# EAGLE board lia (EAGLE 6.1)
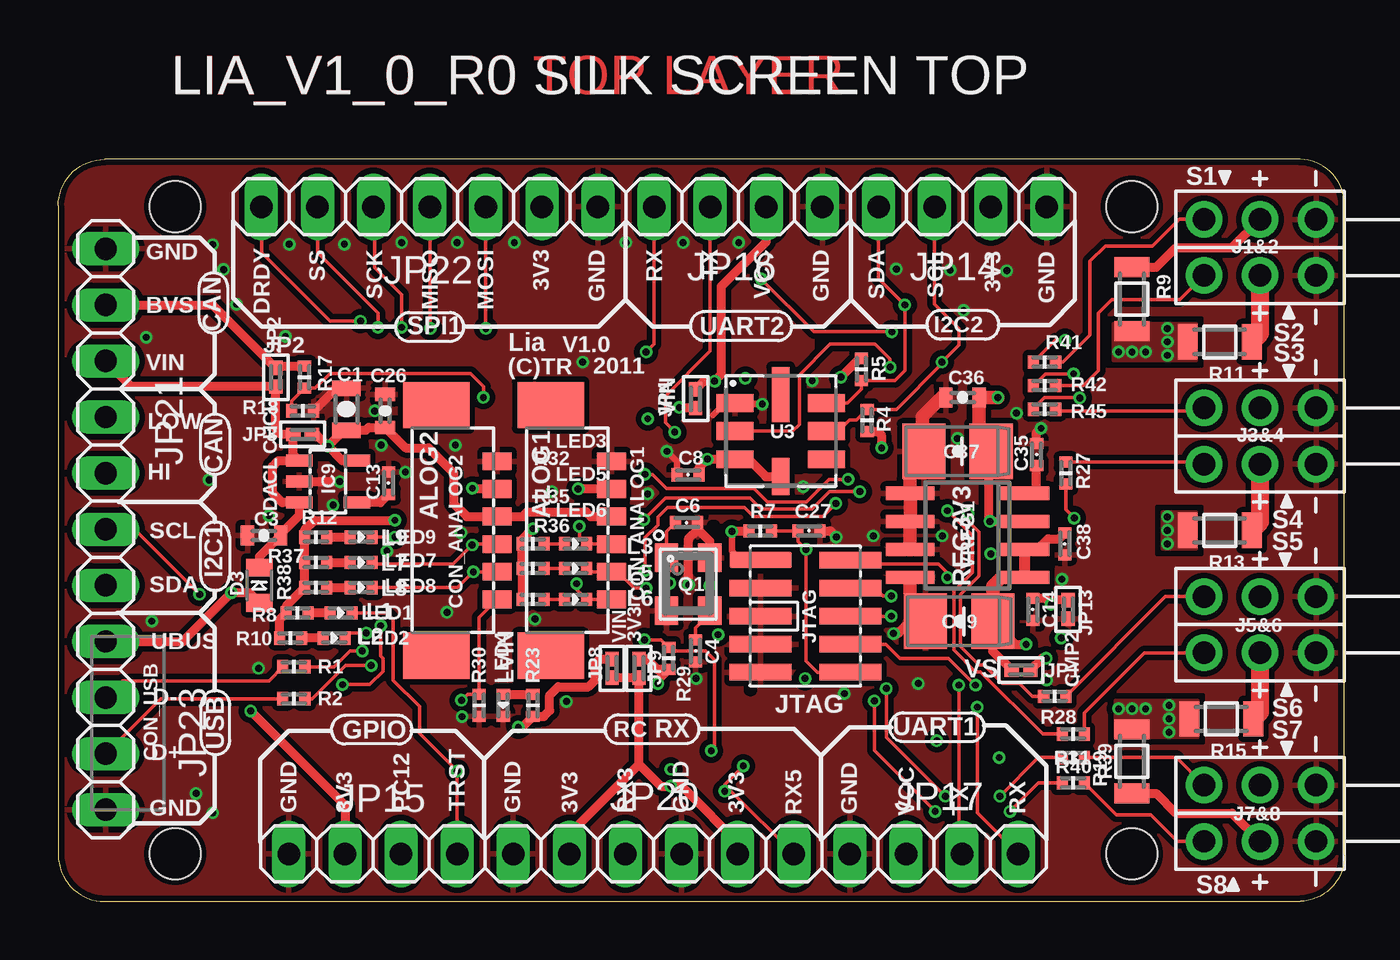
[diagram p3: board, top side]
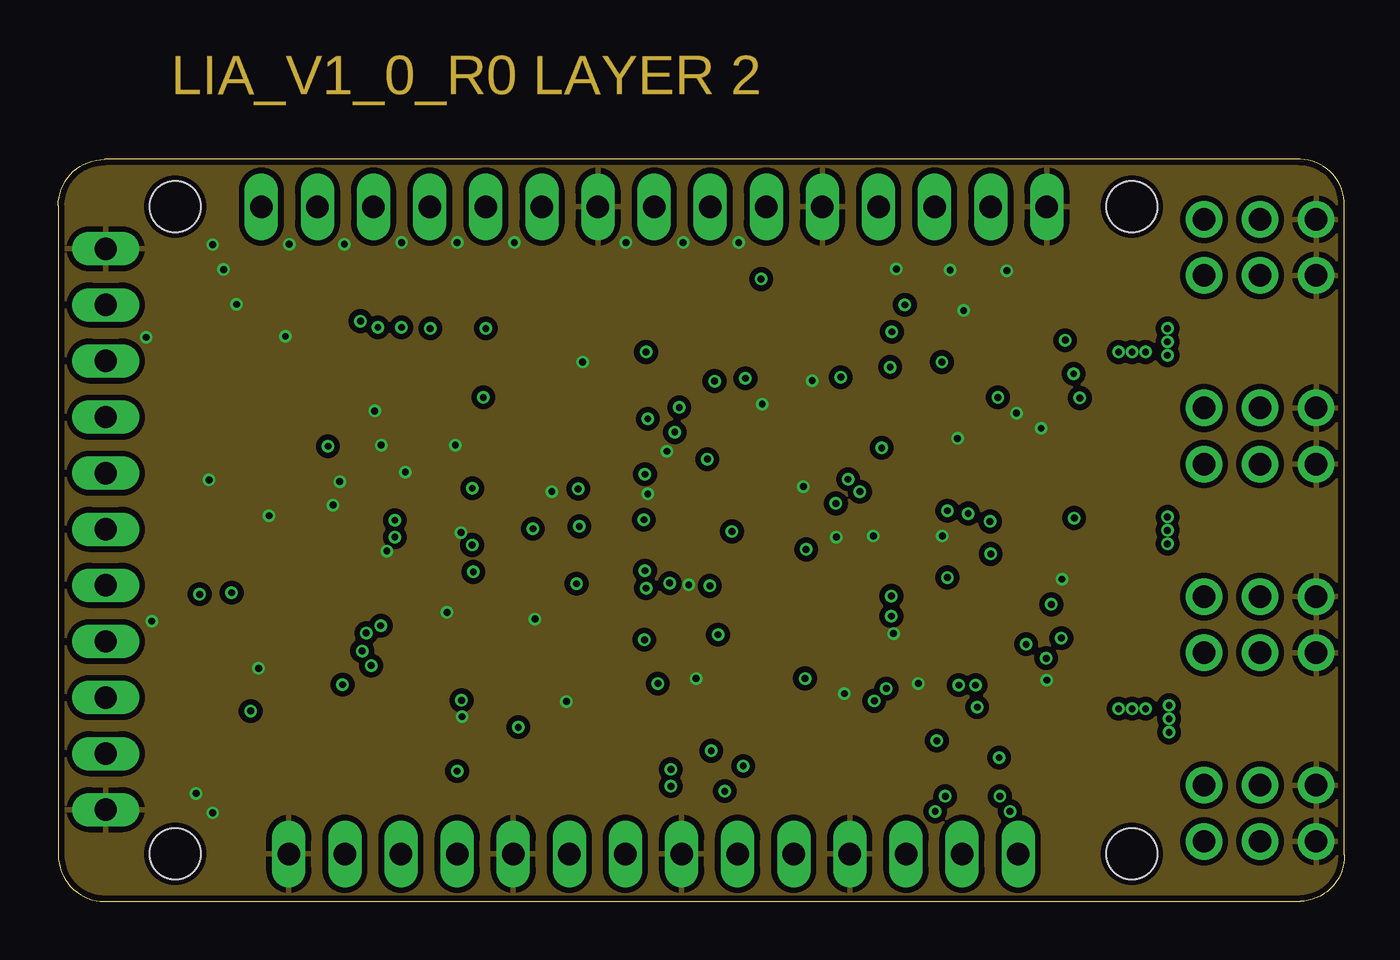
[diagram p4: board, inner layer Route2]
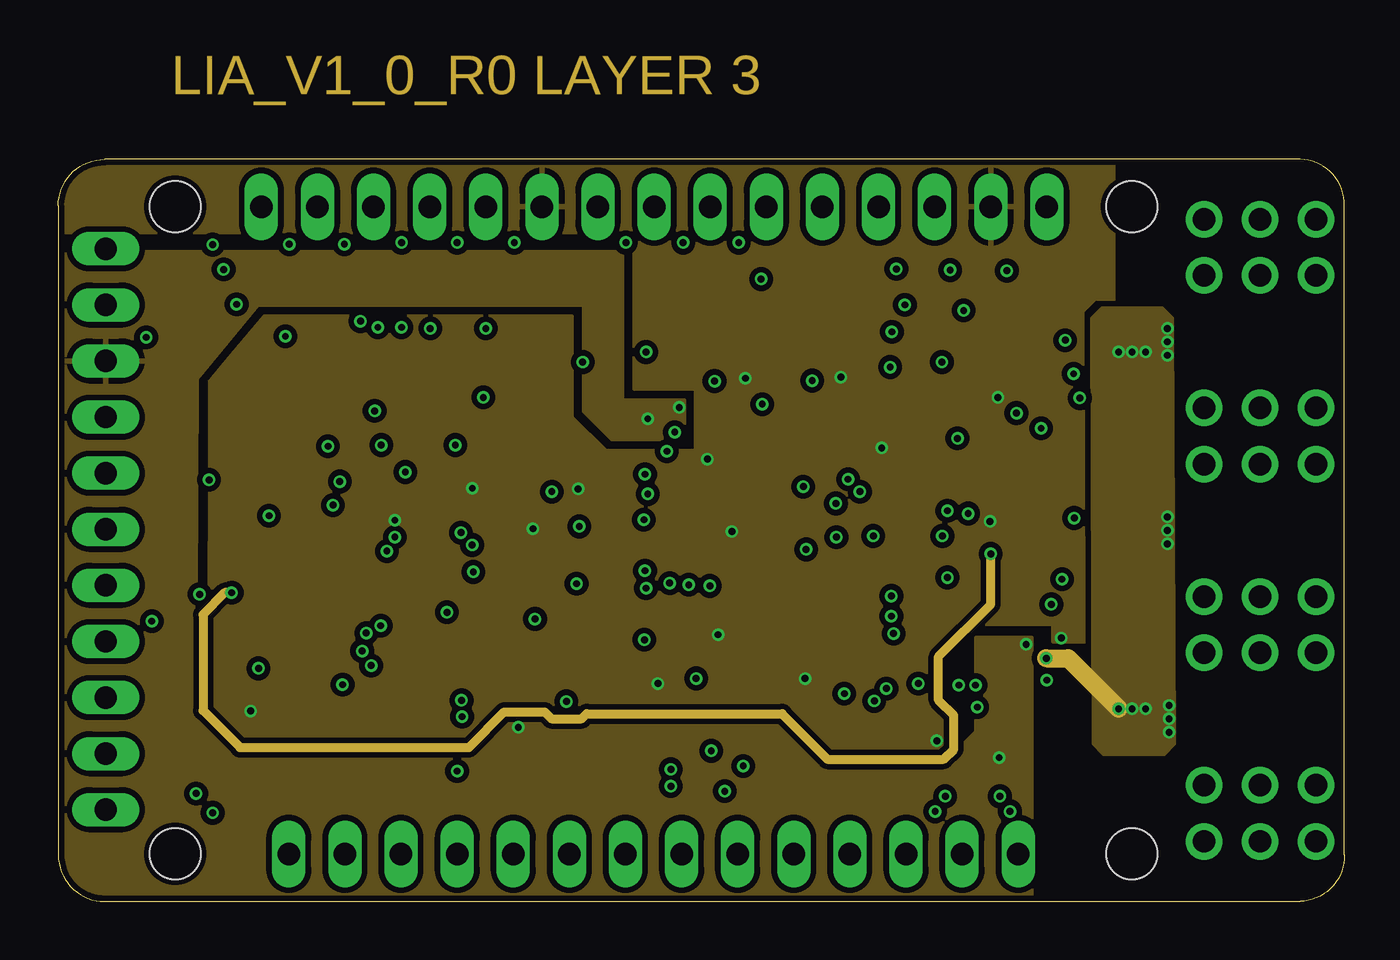
[diagram p5: board, inner layer Route15]
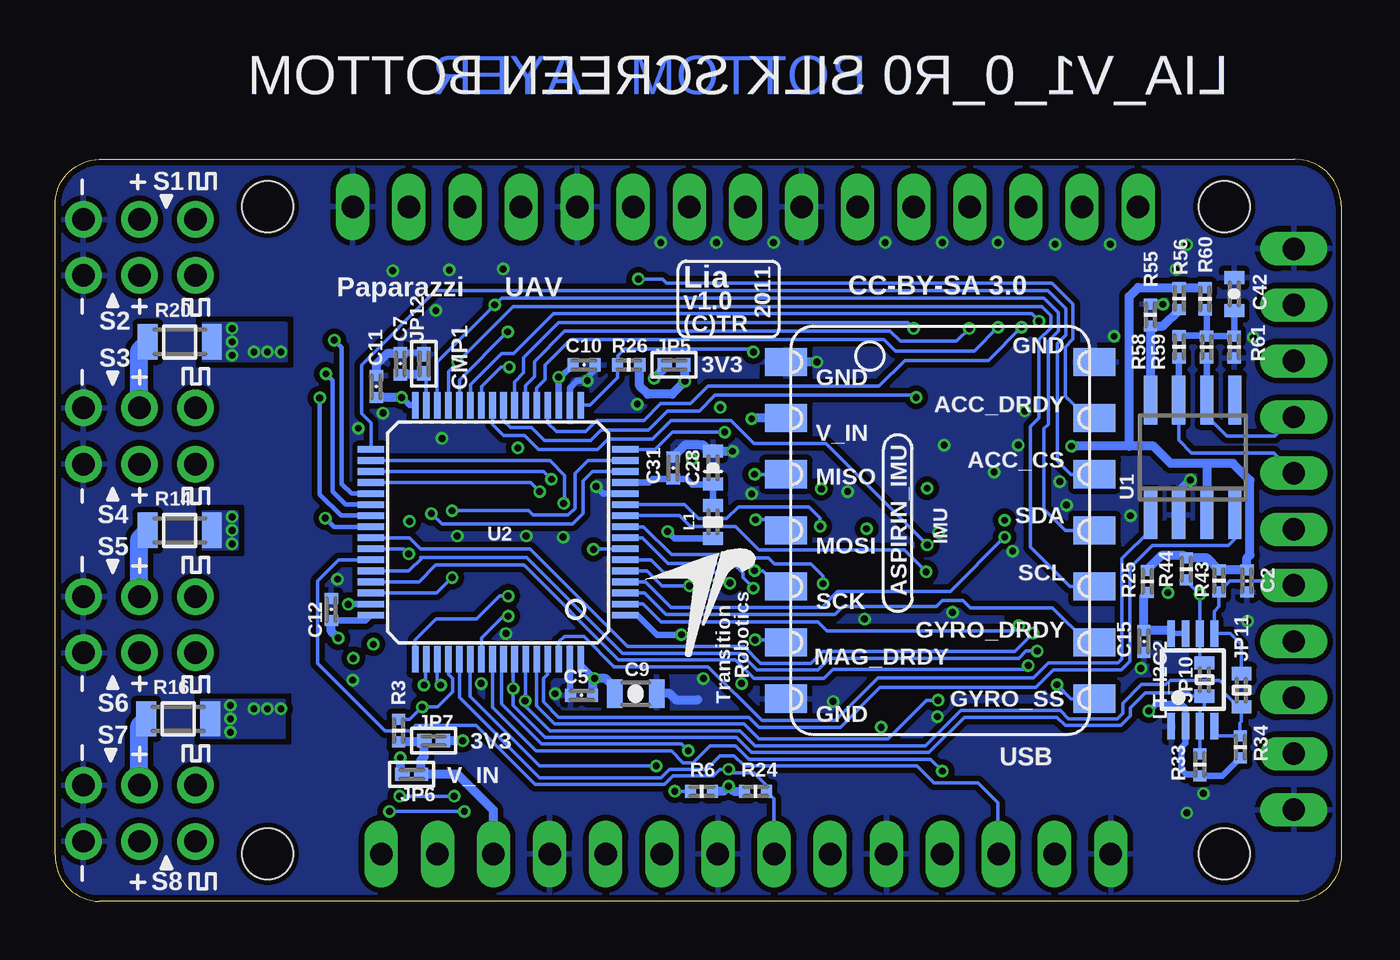
[diagram p6: board, bottom side, seen from below]

Size 58.22 x 33.6 mm. Coordinates in mm from the lower left corner, seen from the top.
Outline: 2.1,0 56.22,0 arc90 58.22,2.1 58.22,31.5 arc90 56.22,33.6 2.1,33.6 arc90 0,31.5 0,2.1 arc90 2.1,0
Copper layers (1*2+15*16): Top 0.035mm / dielectric 0.2mm / Route2 0.035mm / dielectric 1.5mm / Route15 0.035mm / dielectric 0.2mm / Bottom 0.035mm
Design rules: minimum track width 0.15mm, minimum drill 10mil, track to track 0.15mm, track to pad 0.15mm, pad to pad 0.15mm, via to via 0.15mm, smd to smd 0.15mm, copper to edge 10mil, drill to drill 8mil, minimum pad ring 5mil, minimum via ring 5mil, stop-mask expansion 14mil, vias tented up to drill 0.31mm, thermal gap 10mil
Net classes: 0 default: width 0.152 mm, drill 0.305 mm, clearance 0.152 mm
Holes 2.3 mm at 5.3,2.15 5.3,31.45 48.6,31.45 48.6,2.15
tKeepout: area 3.3,0.1 to 7.3,4.2; area 46.6,0.1 to 50.6,4.2; area 3.3,29.4 to 7.3,33.5; area 46.6,29.4 to 50.6,33.5
tRestrict: area 44.8,15.2 to 44.9,15.4; area 42.7,15.1 to 42.8,15.5; area 43.5,20.3 to 43.8,20.3; area 30.5,23.2 to 30.8,23.3; area 34.5,25.2 to 34.6,25.5; area 29.6,16.7 to 29.7,17; area 28.1,16.4 to 28.2,16.6; area 10.6,16.3 to 10.7,16.5; area 16.4,21 to 16.7,21.1; area 43.6,13 to 43.9,13.1; area 39,17.8 to 39.3,17.9; area 26,17.6 to 26.1,17.7; area 29.5,22.6 to 29.6,22.7; area 9.5,14.2 to 9.6,14.4; area 18.9,12 to 19,12.2; area 23.6,18.1 to 24,18.2; area 13.7,20.5 to 13.8,20.7; area 11.8,20.2 to 12.1,20.3; area 33.4,19.6 to 33.6,19.7; area 31.3,9.5 to 31.4,9.7; area 30.1,14.1 to 30.3,14.3; area 35.2,23.2 to 35.4,23.3; area 11.7,24.2 to 11.9,24.3; area 27.4,4.5 to 27.5,4.8
bRestrict: area 5.5,26.9 to 5.7,27; area 11.1,23.5 to 11.3,23.6; area 6.7,16.8 to 6.8,17; area 8,16.8 to 8.1,17; area 8.3,10.4 to 8.4,10.6; area 14.9,12.8 to 15,13; area 30.7,20 to 30.8,20.2; area 33.7,24.7 to 33.9,24.9; area 34.5,9.9 to 34.6,10.1; area 31.6,18.4 to 31.7,18.6; area 31.5,9.3 to 31.6,9.5; area 28.9,19.5 to 29,19.6

## Footprints (pad centres in the part's own frame; a part is rotated, then mirrored left to right if it is on the bottom)
0805-CAP = smd 0.7 x 1.3: P$1 -0.95,0; P$2 0.95,0
0402-CAP = smd 0.5 x 0.6: P$1 -0.5,0; P$2 0.5,0
0603-CAP = smd 0.6 x 0.9: P$1 -0.75,0; P$2 0.75,0
0603-POL-CAP = smd 0.6 x 0.9: + -0.75,0; - 0.75,0
3528/B = smd 1.95 x 2.5: + -1.525,0; - 1.525,0
PB-53398-06 = smd 0.8 x 1.3: 1 -3.125,1.25; 2 -1.875,1.25; 3 -0.625,1.25; 4 0.625,1.25; 5 1.875,1.25; 6 3.125,1.25 | smd 2.1 x 3: PAD1 -5.675,-1.5; PAD2 5.675,-1.5
ZX62-B-5PA = smd 1.8 x 1.9: GND_LEFT -4,0; GND_RIGHT 4,0 | smd 1.9 x 1.9: GND_MID_LEFT -1.2,0; GND_MID_RIGHT 1.2,0 | smd 2.1 x 1.6: GND_UP_LEFT -3.1,2.6; GND_UP_RIGHT 3.1,2.6 | smd 0.4 x 1.35: PIN_1 -1.3,2.725; PIN_2 -0.65,2.725; PIN_3 0,2.725; PIN_4 0.65,2.725; PIN_5 1.3,2.725
MICROMELF-R = smd 0.8 x 1.2: A 0.8,0; C -0.8,0
SOT23-5 = smd 0.55 x 1.2: 1 -0.95,-1.3; 2 0,-1.3; 3 0.95,-1.3; 4 0.95,1.3; 5 -0.95,1.3
ASPIRIN_1 = smd 1.905 x 1.27: P$1 -6.985,7.62; P$2 -6.985,5.08; P$3 -6.985,2.54; P$4 -6.985,0; P$5 -6.985,-2.54; P$6 -6.985,-5.08; P$7 -6.985,-7.62; P$8 6.985,-7.62; P$9 6.985,-5.08; P$10 6.985,-2.54; P$11 6.985,0; P$12 6.985,2.54; P$13 6.985,5.08; P$14 6.985,7.62
SIP1X3_100 = drill 1.016 pad 1.651: 1 2.54,0; 2 0,0; 3 -2.54,0
0402-SQJMP = smd 0.652 x 0.6: P$1 -0.424,0; P$2 0.424,0
0603-RES = smd 0.6 x 0.9: P$1 -0.75,0; P$2 0.75,0
1X04 = drill 1.016 long: 1 -3.81,0; 2 -1.27,0; 3 1.27,0; 4 3.81,0
1X06 = drill 1.016 long: 1 -6.35,0; 2 -3.81,0; 3 -1.27,0; 4 1.27,0; 5 3.81,0; 6 6.35,0
1X07 = drill 1.016 long: 1 -7.62,0; 2 -5.08,0; 3 -2.54,0; 4 0,0; 5 2.54,0; 6 5.08,0; 7 7.62,0
FTSH-105-DV = smd 0.74 x 2.8: 1 -2.54,-2.03; 2 -2.54,2.03; 3 -1.27,-2.03; 4 -1.27,2.03; 5 0,-2.03; 6 0,2.03; 7 1.27,-2.03; 8 1.27,2.03; 9 2.54,-2.03; 10 2.54,2.03
0603-IND = smd 0.6 x 0.9: P$1 -0.75,0; P$2 0.75,0
0402-LED = smd 0.5 x 0.6: A -0.5,0; C 0.5,0
TSSOP_B3 = smd 1.2 x 0.35: 1 -2.925,0.975; 2 -2.925,0.325; 3 -2.925,-0.325; 4 -2.925,-0.975; 5 1.275,-0.975; 6 1.275,-0.325; 7 1.275,0.325; 8 1.275,0.975
ABM8 = smd 1.3 x 1.05: P$1 -1.2,-0.975; P$2 1.2,-0.975; P$3 1.2,0.975; P$4 -1.2,0.975
0402-RES = smd 0.5 x 0.6: P$1 -0.5,0; P$2 0.5,0
1206-RES = smd 0.9 x 1.6: P$1 -1.45,0; P$2 1.45,0
SO-08 = smd 0.6 x 2.2: 1 -1.905,-2.6; 2 -0.635,-2.6; 3 0.635,-2.6; 4 1.905,-2.6; 5 1.905,2.6; 6 0.635,2.6; 7 -0.635,2.6; 8 -1.905,2.6
LQFP64 = smd 1.2 x 0.3: 1 -5.75,3.75; 2 -5.75,3.25; 3 -5.75,2.75; 4 -5.75,2.25; 5 -5.75,1.75; 6 -5.75,1.25; 7 -5.75,0.75; 8 -5.75,0.25; 9 -5.75,-0.25; 10 -5.75,-0.75; 11 -5.75,-1.25; 12 -5.75,-1.75; 13 -5.75,-2.25; 14 -5.75,-2.75; 15 -5.75,-3.25; 16 -5.75,-3.75; 33 5.75,-3.75; 34 5.75,-3.25; 35 5.75,-2.75; 36 5.75,-2.25; 37 5.75,-1.75; 38 5.75,-1.25; 39 5.75,-0.75; 40 5.75,-0.25; 41 5.75,0.25; 42 5.75,0.75; 43 5.75,1.25; 44 5.75,1.75; 45 5.75,2.25; 46 5.75,2.75; 47 5.75,3.25; 48 5.75,3.75 | smd 0.3 x 1.2: 17 -3.75,-5.75; 18 -3.25,-5.75; 19 -2.75,-5.75; 20 -2.25,-5.75; 21 -1.75,-5.75; 22 -1.25,-5.75; 23 -0.75,-5.75; 24 -0.25,-5.75; 25 0.25,-5.75; 26 0.75,-5.75; 27 1.25,-5.75; 28 1.75,-5.75; 29 2.25,-5.75; 30 2.75,-5.75; 31 3.25,-5.75; 32 3.75,-5.75; 49 3.75,5.75; 50 3.25,5.75; 51 2.75,5.75; 52 2.25,5.75; 53 1.75,5.75; 54 1.25,5.75; 55 0.75,5.75; 56 0.25,5.75; 57 -0.25,5.75; 58 -0.75,5.75; 59 -1.25,5.75; 60 -1.75,5.75; 61 -2.25,5.75; 62 -2.75,5.75; 63 -3.25,5.75; 64 -3.75,5.75
LCC8 = smd 1.67 x 0.8: 1 -2.065,1.27; 2 -2.065,0; 3 -2.065,-1.27; 5 2.065,-1.27; 6 2.065,0; 7 2.065,1.27 | smd 0.8 x 1.67: 4 0,-2.065 | smd 0.8 x 2.5: 8 0,1.65
SOIC8 = smd 0.6 x 2.2: 1 -1.905,-2.6; 2 -0.635,-2.6; 3 0.635,-2.6; 4 1.905,-2.6; 5 1.905,2.6; 6 0.635,2.6; 7 -0.635,2.6; 8 -1.905,2.6

## Placement (x,y rotation side)
C1  4u7  [0805-CAP]  13.05,22.29 90 top
C2  100n  [0402-CAP]  4.27,14.51 270 bottom
C3  100n  [0603-CAP]  9.32,16.57 180 top
C4  10p  [0402-CAP]  28.85,11.34 90 top
C5  100n  [0402-CAP]  34.39,9.33 0 bottom
C6  10p  [0402-CAP]  28.45,17.15 0 top
C7  100n  [0402-CAP]  42.6,24.34 270 bottom
C8  100n  [0402-CAP]  28.52,19.31 0 top
C9  4u7  [0805-CAP]  31.95,9.41 0 bottom
C10  100n  [0402-CAP]  34.28,24.29 180 bottom
C11  100n  [0402-CAP]  43.69,23.31 270 bottom
C12  100n  [0402-CAP]  45.72,13.22 270 bottom
C13  10n  [0402-CAP]  14.95,18.93 90 top
C14  100n  [0402-CAP]  44.12,13.22 90 top
C15  100n  [0402-CAP]  8.93,11.77 270 bottom
C26  100n  [0603-CAP]  14.8,22.21 90 top
C27  100n  [0402-CAP]  33.99,16.77 180 top
C28  1u  [0603-POL-CAP]  28.44,19.64 90 bottom
C31  10n  [0402-CAP]  30.25,19.62 270 bottom
C35  470p  [0402-CAP]  44.29,20.23 90 top
C36  100n  [0603-CAP]  40.94,22.82 180 top
C37  22u  [3528/B]  40.71,20.38 180 top
C38  100n  [0402-CAP]  45.57,16.19 270 top
C39  22u  [3528/B]  40.79,12.68 180 top
C42  4n7  [0603-CAP]  4.85,27.5 270 bottom
CON_ANALOG1  [PB-53398-06]  23.79,16.8 270 top
CON_ANALOG2  [PB-53398-06]  18.61,16.8 270 top
CON_USB_MICRO  ZX62-B-5PA  [ZX62-B-5PA]  5.71,-11.35 0 top  (outside the outline)
D3  1N5819  [MICROMELF-R]  9.11,14.31 270 top
IC9  LP2992 5V  [SOT23-5]  12.21,19.01 270 top
IMU  ASPIRIN  [ASPIRIN_1]  18.16,16.8 0 bottom
J1  CONN_3-1  [SIP1X3_100]  54.41,30.88 0 top
J2  CONN_3-1  [SIP1X3_100]  54.41,28.34 0 top
J3  CONN_3-1  [SIP1X3_100]  54.41,22.34 0 top
J4  CONN_3-1  [SIP1X3_100]  54.41,19.8 0 top
J5  CONN_3-1  [SIP1X3_100]  54.41,13.8 0 top
J6  CONN_3-1  [SIP1X3_100]  54.41,11.26 0 top
J7  CONN_3-1  [SIP1X3_100]  54.41,5.26 0 top
J8  CONN_3-1  [SIP1X3_100]  54.41,2.72 0 top
JP1  0/DNP  [0402-SQJMP]  43.59,10.47 180 top
JP2  0/DNP  [0402-SQJMP]  9.85,23.73 90 top
JP3  0/DNP  [0402-SQJMP]  11.07,21.14 0 top
JP4  0/DNP  [0402-SQJMP]  28.85,22.76 90 top
JP5  0/DNP  [0402-SQJMP]  30.21,24.29 0 bottom
JP6  0/DNP  [0402-SQJMP]  42.08,5.75 0 bottom
JP7  0/DNP  [0402-SQJMP]  41.09,7.27 180 bottom
JP8  0/DNP  [0402-SQJMP]  25.07,10.55 270 top
JP9  0/DNP  [0402-SQJMP]  26.29,10.55 270 top
JP10  0/DNP  [0603-RES]  6.19,10.04 90 bottom
JP11  0/DNP  [0603-RES]  4.52,9.56 90 bottom
JP12  0/DNP  [0402-SQJMP]  41.53,24.34 90 bottom
JP13  0/DNP  [0402-SQJMP]  45.72,13.22 270 top
JP14  [1X04]  40.94,31.45 180 top
JP15  [1X04]  14.25,2.15 0 top
JP16  [1X04]  30.78,31.45 180 top
JP17  [1X04]  39.65,2.15 0 top
JP20  [1X06]  26.95,2.15 0 top
JP21  [1X07]  2.15,21.93 270 top
JP22  [1X07]  16.81,31.45 180 top
JP23  [1X04]  2.15,7.96 270 top
JTAG  PIN_HDR_EDG_1.27MM_5-2  [FTSH-105-DV]  33.83,12.91 270 top
L1  [0603-IND]  28.44,17.18 90 bottom
LED1  GRN  [0402-LED]  12.8,13.07 0 top
LED2  RED  [0402-LED]  12.5,11.92 0 top
LED3  BLU  [0402-LED]  23.42,16.19 0 top
LED4  GRN  [0402-LED]  20.15,8.87 270 top
LED5  BLU  [0402-LED]  23.42,15.07 0 top
LED6  BLU  [0402-LED]  23.42,13.68 0 top
LED7  RED  [0402-LED]  13.72,15.35 0 top
LED8  GRN  [0402-LED]  13.72,14.21 0 top
LED9  GRN  [0402-LED]  13.72,16.49 0 top
LT_I2C2  PCA9306DP  [TSSOP_B3]  6.72,10.86 90 bottom
Q1  12Mhz  [ABM8]  28.52,14.36 270 top
R1  0R  [0402-RES]  10.67,10.63 0 top
R2  0R  [0402-RES]  10.67,9.18 0 top
R3  10k  [0402-RES]  42.67,7.73 90 bottom
R4  2k2  [0402-RES]  36.62,21.78 90 top
R5  2k2  [0402-RES]  36.37,24.09 270 top
R6  10k  [0402-RES]  28.96,4.99 180 bottom
R7  10k  [0402-RES]  31.78,16.77 180 top
R8  300  [0402-RES]  10.82,13.07 180 top
R9  1R  [1206-RES]  48.6,27.26 270 top
R10  300  [0402-RES]  10.52,11.92 180 top
R11  1R  [1206-RES]  52.58,25.33 180 top
R12  300  [0402-RES]  11.66,16.49 180 top
R13  1R  [1206-RES]  52.58,16.8 180 top
R14  0R  [1206-RES]  52.58,16.8 0 bottom
R15  0R  [1206-RES]  52.65,8.26 180 top
R16  0R  [1206-RES]  52.65,8.26 0 bottom
R17  10k  [0402-RES]  11.14,23.73 270 top
R18  2k2  [0402-RES]  11.07,22.21 0 top
R19  0R  [1206-RES]  48.6,6.33 90 top
R20  1R  [1206-RES]  52.58,25.33 0 bottom
R23  2k2  [0402-RES]  21.49,8.87 270 top
R24  10k  [0402-RES]  26.52,4.99 0 bottom
R25  200k  [0402-RES]  8.78,14.49 90 bottom
R26  10k  [0402-RES]  32.26,24.29 180 bottom
R27  100R  [0402-RES]  45.62,19.39 270 top
R28  100R  [0402-RES]  45.11,9.28 180 top
R29  10k  [0402-RES]  27.63,11.01 90 top
R30  10k  [0402-RES]  19.05,8.87 90 top
R31  100R  [0402-RES]  45.95,7.58 180 top
R32  80R  [0402-RES]  21.49,16.19 180 top
R33  2k2  [0402-RES]  6.4,6.19 270 bottom
R34  2k2  [0402-RES]  4.57,6.99 270 bottom
R35  80R  [0402-RES]  21.49,15.07 180 top
R36  80R  [0402-RES]  21.49,13.68 180 top
R37  300  [0402-RES]  11.66,15.35 180 top
R38  300  [0402-RES]  11.66,14.21 180 top
R39  100R  [0402-RES]  45.95,6.51 180 top
R40  100R  [0402-RES]  45.95,5.37 180 top
R41  100R  [0402-RES]  44.65,24.42 180 top
R42  100R  [0402-RES]  44.65,23.35 180 top
R43  2k2  [0402-RES]  5.54,14.51 90 bottom
R44  2k2  [0402-RES]  7.01,15.05 90 bottom
R45  100R  [0402-RES]  44.65,22.29 180 top
R55  0/10k  [0402-RES]  8.64,26.55 270 bottom
R56  0/DNP  [0402-RES]  7.34,27.3 90 bottom
R58  60R/DNP  [0402-RES]  7.34,25.11 90 bottom
R59  60R/DNP  [0402-RES]  6.1,25.1 270 bottom
R60  4k7/DNP  [0402-RES]  6.17,27.28 270 bottom
R61  4k7/DNP  [0402-RES]  4.85,25.1 270 bottom
U1  MCP2551SN  [SO-08]  6.72,20.1 0 bottom
U2  STM32-C-64  [LQFP64]  38.17,16.71 180 bottom
U3  BMP085  [LCC8]  32.71,21.3 0 top
U$1  TR-LOGO  [TR-LOGO]  29.02,13.51 0 bottom
VREG1  MIC5209  [SOIC8]  41.17,16.57 90 top

## Tracks (layer width: path | path; a pad name or v marks a point on that pad's centre or on a via)
+3V3  (via drill 0.31)
  Top 0.152: 30.91,15.45 JTAG.1
  Top 0.305: v30.5,16.75 30.5,15.87 30.91,15.45
  Top 0.406: CON_ANALOG2.2 18.77,18.67 v18.75,18.7 | U3.4 32.04,19.23 31.24,20.02 U3.3 v29.39,20.02 29.02,19.66 C8.P$2 | CON_ANALOG1.2 v23.54,18.67 v23.54,18.68 | R5.P$1 36.28,24.59 v35.43,23.73 | R4.P$1 37.1,21.28 37.26,21.12 37.26,20.55 v37.28,20.53 | R7.P$2 30.52,16.77 v30.5,16.75 | v42.18,17.21 VREG1.3 | 42.14,17.26 42.14,20.38 | v27.15,9.87 27.15,10.02 R29.P$1 27.13,10.5 26.65,10.97 JP9.P$1 | R10.P$2 10.02,12.76 R8.P$2 10.32,13.37 R38.P$2 R37.P$2 R12.P$2 11.16,16.83 11.58,17.26 v15.24,17.26 | R36.P$2 R35.P$2 R32.P$2 20.99,16.38 v21.49,16.88 | JP15.2 12.98,4.35 v8.71,8.62
  Top 0.61: v42.54,22.82 C36.P$1 41.69,20.6 41.62,20.53 41.62,20.46 41.7,20.38 42.14,20.38 C37.+ 42.23,19.69
  Bottom 0.305: 43.87,12.96 U2.48 44.17,12.72 C12.P$2 | L1.P$1 30.18,16.43 v30.5,16.75 | v8.71,8.62 8.38,8.95 7.24,8.95 7.05,8.76 LT_I2C2.2 7.05,7.16 7.24,6.97 7.24,5.98 7.01,5.75 6.46,5.75 R33.P$2 6.39,5.67 5.39,5.67 R34.P$2 | C10.P$2 35.34,23.73 v35.43,23.73 v35.42,23.74 U2.19 | U2.32 42.18,22.46 v42.54,22.82 42.55,22.81 | C9.P$1 32.9,9.69 | U2.1 31.88,12.96 30.99,12.07 v29.87,12.07 | U2.64 34.42,10.71 v33.81,10.09
  Bottom 0.406: 42.55,22.81 C11.P$2 | 32.9,9.69 33.3,10.09 v33.81,10.09 33.89,10.02 C5.P$2 | v39.78,7.27 JP7.P$1 | JP5.P$1 30.63,24.16 v31.11,23.68 | C12.P$2 45.72,12.23 v45.41,11.92
  pour Route15 (isolate 0.254, rank 2): 19.58,7.4 8.41,7.45 6.83,9.03 6.85,23.58 9.32,26.5 23.27,26.5 23.27,21.93 24.79,20.41 28.85,20.41 28.85,23.2 26.06,23.2 26.06,30.29 0.3,30.29 0.3,33.6 47.8,33.6 47.8,28.38 47.72,11.74 45.03,11.74 45.03,12.53 41.09,12.51 41.09,7.91 40.02,6.94 34.72,6.94 32.66,8.98 28.35,8.98 26.57,7.2 25.04,7.2 23.39,8.85 20.98,8.85
+5V  (via drill 0.31)
  Top 0.406: CON_ANALOG1.3 24.11,17.42 23.9,17.64 21.23,17.64 21.03,17.43 21.03,17.42 CON_ANALOG2.3 18.5,17.42 17.91,18.02 17.91,19.39 16.76,20.53 15.73,20.53 C26.P$1 14.06,21.46 13.93,21.34 C1.P$1 12.94,21.34 v12.21,20.61 | JP3.P$2 11.68,21.14 v12.21,20.61 | IC9.5 12.86,19.96 v12.21,20.61
  Bottom 0.406: 9.6,20.61 8.5,20.61 7.72,19.83 6.09,19.83 | 9.6,20.61 v12.21,20.61 | 6.09,19.83 U1.3 | R60.P$1 7.33,27.78 R56.P$2 9.2,27.8 9.6,27.39 9.6,20.61 | 6.09,19.83 4.91,19.83 4.14,19.06 4.14,15.68 4.27,15.55 C2.P$1 R43.P$2 6.07,15.55 R44.P$2 7.12,15.66 8.15,15.66 8.78,15.03 R25.P$2
ADC_1  (via drill 0.31)
  Top 0.152: 25.06,16.19 CON_ANALOG1.4 23.93,16.17 LED3.C 23.59,16.52 v23.59,16.98
  Bottom 0.152: U2.11 29.73,17.96 29.1,17.33 27.83,17.33 27.3,17.87 24.1,17.87 23.59,17.36 v23.59,16.98
ADC_2  (via drill 0.31)
  Top 0.152: v26.61,14.18 26.06,14.18 25.32,14.92 CON_ANALOG1.5 24.07,14.92 LED5.C
  Bottom 0.152: U2.8 31.64,16.46 30.47,15.3 27.53,15.3 27.1,14.87 27.1,14.67 v26.61,14.18
ADC_3  (via drill 0.31)
  Top 0.152: 25.07,13.65 CON_ANALOG1.6 LED6.C 23.46,14.13 v23.46,14.39
  Bottom 0.152: U2.9 31.58,16.96 30.32,15.71 27.05,15.71 26.9,15.55 25.93,15.55 25.65,15.28 24,15.28 23.47,14.74 v23.47,14.39 v23.46,14.39
ADC_4  (via drill 0.31)
  Top 0.152: 19.88,16.19 CON_ANALOG2.4 18.77,16.17 v18.74,16.14 17.88,15.28 14.29,15.28 LED7.C
  Bottom 0.152: U2.25 38.42,21.6 37.92,21.09 36.98,21.09 36.35,20.46 33.68,20.46 33.2,20.94 31.19,20.94 30.35,21.78 27.63,21.78 26.59,20.74 23.34,20.74 v18.74,16.14
ADC_6  (via drill 0.31)
  Top 0.152: CON_ANALOG2.5 v18.8,14.92 v18.79,14.92 18.08,14.21 LED8.C
  Bottom 0.152: U2.10 29.95,17.46 29.46,16.98 27.43,16.98 26.36,15.91 19.78,15.91 v18.79,14.92
BARO_DRDY  (via drill 0.31)
  Top 0.152: U3.2 33.24,21.3 33.55,21.6 33.55,23.84 34.94,25.23 36.98,25.23 37.66,24.55 v37.66,24.19
  Bottom 0.152: U2.26 38.92,23.31 38.04,24.19 v37.66,24.19
BOOT0  (via drill 0.31)
  Top 0.152: CON_ANALOG2.6 | CON_ANALOG2.6 19.05,12.86 R30.P$2 18.53,9.37 v18.26,9.1
  Bottom 0.152: U2.60 36.42,8.86 35.6,8.04 27.05,8.04 26.36,7.35 20.52,7.35 18.77,9.1 v18.26,9.1
CAN_CENTER
  Bottom 0.305: R58.P$2 6.11,25.61 R59.P$1 | R59.P$1 6.1,26.71 R60.P$2 | R59.P$1 R61.P$1 C42.P$2
CAN_H
  Bottom 0.152: U1.7 7.36,20.88 6.78,20.3 3.06,20.3 JP21.5
  Bottom 0.305: U1.7 7.36,24.59 R58.P$1
CAN_L
  Bottom 0.152: JP21.4 3.01,21.07 5.18,21.07 6.09,21.98 U1.6
  Bottom 0.305: U1.6 R59.P$2
CAN_RX
  Bottom 0.152: U1.4 4.82,16.42 5.12,16.11 8.55,16.11 9.57,15.09 9.57,10.86 9.96,10.47 13.03,10.47 13.82,9.69 20.88,9.69 22.68,7.88 26.36,7.88 26.82,8.34 35.43,8.34 36.12,9.03 36.12,10.09 35.92,10.29 U2.61
CAN_TX
  Bottom 0.152: U2.62 35.42,11.75 35.17,12 34.29,12 32.92,10.63 28.67,10.63 26.23,8.19 22.91,8.19 20.97,10.12 13.94,10.12 13.26,10.8 10.11,10.8 9.93,10.99 9.93,15.52 8.63,16.82 U1.1
EXTSPI_DRDY  (via drill 0.31)
  Top 0.152: v13.69,26.27 12.32,26.27 9.22,29.37 9.22,31.43 JP22.7
  Bottom 0.152: U2.27 39.42,23.4 38.02,24.8 37.47,24.8 35.66,26.6 14.02,26.6 v13.69,26.27
EXTSPI_MISO  (via drill 0.31)
  Top 0.152: v16.84,25.94 16.84,31.43 JP22.4
  Bottom 0.152: U2.22 36.92,23.36 36.52,23.76 36.52,24.45 35.15,25.82 20.42,25.82 19.96,25.36 17.42,25.36 v16.84,25.94
EXTSPI_MOSI  (via drill 0.31)
  Top 0.152: v19.35,25.94 JP22.3
  Bottom 0.152: U2.23 37.42,23.52 37.01,23.94 37.01,24.62 35.43,26.2 19.61,26.2 v19.35,25.94
EXTSPI_SCK  (via drill 0.31)
  Top 0.152: v15.54,25.99 15.54,27.47 14.32,28.69 14.32,31.4 JP22.5
  Bottom 0.152: U2.21 36.42,23.25 36.04,23.63 36.04,24.29 34.9,25.43 20.7,25.43 20.19,24.93 16.61,24.93 v15.54,25.99
EXTSPI_SS  (via drill 0.31)
  Top 0.152: v14.47,25.99 14.47,26.64 11.73,29.37 JP22.6
  Bottom 0.152: U2.20 35.92,21.66 35.53,21.27 34.21,21.27 33.7,21.78 31.57,21.78 30.81,22.54 29.46,22.54 28.68,23.33 20.93,23.33 19.76,24.5 15.97,24.5 v14.47,25.99
FT_USB_DM
  Top 0.152: R1.P$1 10.17,10.61 9.55,9.99 2.91,9.99 JP23.2
FT_USB_DP
  Top 0.152: 9.98,9.33 10.13,9.18 R2.P$1 4.64,9.18 JP23.3
GND  (via drill 0.31)
  Top 0.305: CON_ANALOG1.1 25.01,19.92 | v31.87,22.51 30.59,22.51 30.61,22.54 | 30.61,22.54 U3.1 | 39.09,20.66 39.12,20.64 39.12,20.89 | C8.P$1 28.02,19.91 v27.55,20.38 | 30.61,22.54 30.14,22.54 29.64,22.03
  Top 0.406: 38.57,13.99 39.22,13.33 38.04,12.15 37.8,12.15 | IC9.2 v12.74,19.01 | C1.P$2 12.6,23.24 R18.P$2 | C35.P$2 44.29,21.22 v44.49,21.42 | C27.P$1 34.95,16.77 v35.23,16.49 | 28.83,10.81 C4.P$1 28.86,10.83 | v28.54,14.34 28.54,16.44 28.93,16.82 28.93,17.13 C6.P$2 28.96,16.85 29.49,16.32 29.49,15.61 29.51,15.58
  Top 0.61: VREG1.7 VREG1.6 | 38.57,13.99 VREG1.8 | 39.22,13.33 39.87,12.68 | 38.88,20.53 38.57,20.22 VREG1.5 38.58,18.47 38.58,17.18 | C36.P$2 39.98,22.82 39.12,21.95 39.12,20.45 C37.-
  Bottom 0.305: U1.2 7.36,16.67 | U2.12 33.41,18.46 v33.73,18.78 | U2.18 34.92,23.25 34.59,23.57 34.59,23.58 v34.13,23.58 34.13,23.74 33.78,24.09 C10.P$1 | C7.P$1 41.65,24.84 41.53,24.72 | U2.63 34.92,9.37 C5.P$1
  Bottom 0.406: v27.55,20.38 27.57,20.39 C28.- 28.61,20.39 28.91,20.68 29.68,20.68 C31.P$1 | U1.2 7.36,18.55 v6.83,19.09 | C9.P$2 30.4,9.41 30.12,9.13 29.13,9.13 | C11.P$1 43.69,24.32 43.2,24.8 42.64,24.8 C7.P$1 | v8.08,27.04 8.59,27.04 8.61,27.01 | v23.74,24.42 25.22,24.42
  other vias: 10.28,25.59 3.98,25.54 23.01,9.05 14.33,22.21 12.44,17.94 42.95,28.56 10.46,29.75 12.95,29.75 15.54,29.83 20.65,29.83 18.06,29.83 25.7,29.83 28.29,29.83 30.8,29.83 17.6,13.09 40.02,16.55 7.49,28.61 9.54,17.46 6.24,4.89 15.72,19.44 26.69,18.45 38.94,9.87 17.98,20.66 22.35,18.55 18.28,8.37 37.94,28.64 40.38,28.58 21.58,12.79 6.99,4.01 6.99,29.74 35.59,9.41 28.88,10.09 40.99,26.76 37.81,12.13 45.44,14.59 44.75,10.02 9.07,10.55 18.23,16.7 14.88,15.86 14.62,20.66 40.71,20.96 36.9,16.55 43.38,22.11 4.24,12.68
  pour Route2 (isolate 0.254): 0,0 0,33.6 58.22,33.6 58.22,0
  pour Bottom (isolate 0.254, rank 2): 0,0 0,33.6 58.22,33.6 58.22,0
  pour Top (isolate 0.254, rank 2): 0,33.6 58.22,33.6 58.22,0 0,0
I2C2_SCL  (via drill 0.31)
  Top 0.152: U3.6 35.31,21.3 35.81,21.8 36.15,21.8 R4.P$2 37.94,22.28 40.01,24.34 v40.01,24.42 40.77,25.18 40.77,25.94 39.67,27.04 JP14.3
  Bottom 0.152: IMU.P$10 12.29,14.26 14.07,16.04 14.07,21.5 13.69,21.88 13.69,25.43 13.16,25.97 13.16,26.53 13.56,26.93 37.49,26.93 v40.01,24.42 40.42,24 U2.29
I2C2_SDA  (via drill 0.31)
  Top 0.152: U3.7 35.73,22.57 36.37,23.2 R5.P$2 37.88,23.59 38.33,24.04 v38.33,27.01 37.13,28.2 JP14.4
  Bottom 0.152: IMU.P$11 12.49,16.8 13.46,17.76 13.46,21.4 13.26,21.6 13.26,25.36 12.8,25.82 12.8,26.65 13.46,27.32 38.02,27.32 v38.33,27.01 40.92,24.41 U2.30
IMU_ACC_CS
  Bottom 0.152: IMU.P$12 12.24,19.34 12.85,19.95 12.85,25.26 12.47,25.64 12.47,26.83 13.28,27.64 40.99,27.64 44.35,24.29 44.35,22.09 43.92,21.66 U2.33
IMU_ACC_DRDY  (via drill 0.31)
  Top 0.152: v37.74,25.79 34.21,25.79 v31.82,28.18
  Bottom 0.152: IMU.P$13 11.5,21.88 12.36,22.74 12.37,22.74 12.5,22.87 12.5,25.11 12.14,25.46 12.14,27.04 13.11,28 30.56,28 30.73,28.18 v31.82,28.18 | U2.28 39.92,23.61 v37.74,25.79
IMU_GYRO_DRDY
  Bottom 0.152: U2.3 31.55,13.96 30.58,12.99 22.91,12.99 22.55,13.35 18.34,13.35 18.06,13.62 17.12,13.62 16.79,13.29 13.08,13.29 11.51,11.72 IMU.P$9
IMU_GYRO_SS  (via drill 0.31)
  Top 0.152: v12.87,9.81 14.1,9.81 14.71,10.42 14.71,11.01 14.6,11.12 v14.6,12.48
  Bottom 0.152: U2.2 31.61,13.46 30.8,12.66 23.7,12.66 23.29,12.25 14.83,12.25 v14.6,12.48 | IMU.P$8 12.24,9.18 v12.87,9.81
IMU_MAG_DRDY  (via drill 0.31)
  Top 0.152: v26.54,11.85 27.3,11.85 R29.P$2 27.77,11.51 27.94,11.34 29.31,11.34 29.72,10.93 29.72,6.97 v29.57,6.82
  Bottom 0.152: IMU.P$6 25.45,11.72 25.58,11.85 v26.54,11.85 | U2.57 38.02,10.86 38.02,8.95 36.2,7.12 29.87,7.12 v29.57,6.82
IMU_SPI_MISO  (via drill 0.31)
  Top 0.152: v26.56,19.34 26.9,19.34 27.53,18.7 31.49,18.7 32.1,18.09 33.88,18.09 34.89,19.11 v35.76,19.11
  Bottom 0.152: IMU.P$3 v26.56,19.34 | U2.35 36.11,19.46 v35.76,19.11
IMU_SPI_MOSI  (via drill 0.31)
  Top 0.152: v36.29,18.55 34.92,18.55 34.13,17.76 31.82,17.76 31.31,18.27 27.5,18.27 v26.51,17.28
  Bottom 0.152: U2.36 36.7,18.96 v36.29,18.55 | v26.51,17.28 25.62,17.28 IMU.P$4
IMU_SPI_SCK  (via drill 0.31)
  Top 0.152: v26.56,14.97 26.56,16.47 27.15,17.05 27.15,17.41 27.58,17.84 31.06,17.84 31.46,17.43 34.62,17.43 v35.2,18.02
  Bottom 0.152: IMU.P$5 25.14,14.23 25.45,14.23 26.19,14.97 v26.56,14.97 | U2.34 35.82,19.96 35.15,19.29 35.15,18.07 v35.2,18.02
JTAG_RST  (via drill 0.31)
  Top 0.152: JTAG.10 34.37,10.37 33.86,10.88 v33.86,15.94 33.49,16.3 C27.P$2 R7.P$1
  Bottom 0.152: v33.86,15.94 33.83,15.96 U2.7
JTAG_TCK  (via drill 0.31)
  Top 0.152: v37.72,13.83 37.34,13.83 36.98,14.18 JTAG.4
  Bottom 0.152: U2.49 41.92,11.83 40.97,12.79 39.14,12.79 38.1,13.83 v37.72,13.83
JTAG_TDI  (via drill 0.31)
  Top 0.152: JTAG.8 37.47,11.64 38.1,11.01 40.31,11.01 v41.53,9.79
  Bottom 0.152: v41.53,9.79 41.45,9.87 41.45,10.94 U2.50
JTAG_TDO  (via drill 0.31)
  Top 0.152: v37.72,12.91 JTAG.6
  Bottom 0.152: U2.55 38.92,11.94 37.95,12.91 v37.72,12.91
JTAG_TMS  (via drill 0.31)
  Top 0.152: 35.86,15.46 JTAG.2 36.03,15.28 39.85,15.28 40.25,14.87 v40.25,14.67
  Bottom 0.152: U2.46 40.95,13.96 v40.25,14.67
JTAG_TRST  (via drill 0.31)
  Top 0.152: LED1.C 14.86,13.06 15.16,12.76 15.16,10.02 16.35,8.83 16.35,7.61 v18.06,5.9 JP15.4
  Bottom 0.152: v18.06,5.9 18.59,6.44 26.82,6.44 27.43,7.05 28.57,7.05 29.34,6.28 29.79,6.28 30.33,6.82 36.45,6.82 38.42,8.79 U2.56
LED1  (via drill 0.31)
  Top 0.152: LED2.C 13.22,12.15 v13.94,12.15
  Bottom 0.152: U2.41 42.18,16.46 41.68,15.96 36.73,15.96 32.31,11.54 27.05,11.54 26.29,10.78 24,10.78 23.47,11.31 14.78,11.31 v13.94,12.15
LED2  (via drill 0.31)
  Top 0.152: LED9.C v15.24,16.49
  Bottom 0.152: U2.4 31.49,14.46 30.35,13.32 23.52,13.32 22.81,14.03 17.7,14.03 v15.24,16.49
LT_I2C1_SCL  (via drill 0.31)
  Top 0.152: v6.4,13.9 3.45,16.85 JP21.6
  Bottom 0.152: JP10.P$2 6.4,11 LT_I2C2.6 v6.4,13.9 7.01,14.51 R44.P$1 7.27,14.55
LT_I2C1_SDA
  Bottom 0.152: JP11.P$2 4.51,11.61 5.03,12.13 LT_I2C2.5 5.75,13.13 5.54,13.35 R43.P$1 5.04,14.51 2.35,14.51 JP21.7
N$1
  Bottom 0.406: U1.8 R55.P$2 8.07,26.05 7.34,26.78 R56.P$1
N$2
  Bottom 0.813: R14.P$1 54.41,16.42 J5.2
N$3
  Top 0.813: R15.P$1 54.41,8.57 J6.2
N$4
  Top 0.406: LED2.A R10.P$1
N$5
  Top 0.152: R32.P$1 LED3.A
N$6
  Top 0.406: IC9.4 14.58,18.06 C13.P$1
N$7
  Top 0.406: C35.P$1 44.29,18.58 44.3,18.58 43.87,18.58 VREG1.4
N$8
  Bottom 0.254: LT_I2C2.7 LT_I2C2.8
  Bottom 0.406: R25.P$1 8.94,13.84 C15.P$1 7.84,12.27 LT_I2C2.8
N$9
  Top 0.152: R35.P$1 LED5.A
N$10
  Top 0.406: LED1.A R8.P$1
N$11
  Top 0.152: R36.P$1 LED6.A
N$12
  Top 0.406: LED4.A R23.P$1
N$13
  Top 0.406: R12.P$1 LED9.A
N$14
  Top 0.406: R37.P$1 LED7.A
N$15
  Top 0.406: R38.P$1 LED8.A
N$16
  Bottom 0.813: R16.P$1 54.41,7.96 J7.2
N$17
  Top 0.406: J8.2 53.13,4 50.6,4 49.71,4.88 R19.P$1
N$18
  Top 0.813: R13.P$1 54.41,17.18 J4.2
N$19
  Bottom 0.813: R20.P$1 54.41,24.95 J3.2
N$20
  Top 0.813: R11.P$1 54.41,25.72 J2.2
N$21
  Top 0.406: J1.2 53.13,29.6 50.6,29.6 49.71,28.71 R9.P$1
OSC_IN  (via drill 0.31)
  Top 0.152: v29.5,14.29 v29.49,14.28 Q1.P$3 29.49,13.02 28.85,12.38 C4.P$2
  Bottom 0.152: U2.5 31.43,14.96 30.75,14.29 v29.5,14.29
OSC_OUT  (via drill 0.31)
  Top 0.152: v27.68,14.41 27.54,14.55 Q1.P$1 27.54,16.75 C6.P$1
  Bottom 0.152: U2.6 31.25,15.46 30.68,14.89 28.16,14.89 v27.68,14.41
PC12
  Bottom 0.152: U2.53 39.92,9.23 36.29,5.6 30.78,5.6 30.4,5.98 28.73,5.98 28.12,6.59 27.48,6.59 27.02,6.13 19.2,6.13 18.44,5.37 16.46,5.37 15.54,4.46 15.54,2.17 JP15.3
S1
  Top 0.152: R41.P$1 45.49,24.42 46.71,25.64 46.71,28.99 47.4,29.68 49.53,29.68 50.75,30.9 51.85,30.9 J1.3
S2
  Top 0.152: R42.P$1 46.41,23.35 47.09,24.04 47.09,26.63 47.7,27.24 50.77,27.24 J2.3
S3
  Top 0.152: J3.3 51.74,22.21 45.23,22.21 R45.P$1
S4
  Top 0.152: R27.P$1 51.78,19.89 J4.3
S5
  Top 0.152: R28.P$1 50.13,13.8 J5.3
S6
  Top 0.152: J6.3 49.17,11.26 46.45,8.54 R31.P$1
S7
  Top 0.152: R39.P$1 50.62,6.51 J7.3
S8
  Top 0.152: R40.P$1 47.9,3.92 49.45,3.92 50.66,2.72 J8.3
SERVO_1  (via drill 0.31)
  Top 0.152: R41.P$2 45.14,25.41 v45.59,25.41
  Bottom 0.203: v45.59,25.41 45.26,25.08 45.26,18.91 44.81,18.46 U2.37
SERVO_2  (via drill 0.31)
  Top 0.152: R42.P$2 44.69,23.89 v45.97,23.89
  Bottom 0.203: U2.38 45.08,17.96 45.66,18.55 45.66,23.58 v45.97,23.89
SERVO_3  (via drill 0.31)
  Top 0.152: R45.P$2 44.15,22.32 44.65,22.82 46.22,22.82 v46.25,22.79
  Bottom 0.203: U2.39 45.29,17.46 46.25,18.43 v46.25,22.79
SERVO_4  (via drill 0.31)
  Top 0.152: R27.P$2 45.62,17.73 v45.99,17.36
  Bottom 0.203: U2.40 45.6,16.96 v45.99,17.36
SERVO_5  (via drill 0.31)
  Top 0.152: v41.19,17.56 41.19,17.21 41.68,16.72 41.68,14.74 40.84,13.9 40.84,11.54 41.68,10.7 41.91,10.7 42.75,9.87 43.51,9.87 44.09,9.28 R28.P$2
  Bottom 0.152: U2.14 33.89,19.46 34.31,19.03 34.31,17.56 34.79,17.08 40.71,17.08 v41.19,17.56
SERVO_6  (via drill 0.31)
  Top 0.152: v40.25,17.69 41.38,16.57 41.38,14.89 40.54,14.06 40.54,11.39 41.53,10.4 41.76,10.4 44.58,7.58 R31.P$2
  Bottom 0.152: v40.25,17.69 36.8,17.69 36.59,17.48 34.99,17.48 34.69,17.79 34.69,19.36 34.09,19.96 U2.15
SERVO_7/I2C1_SCL  (via drill 0.31)
  Top 0.152: v40.16,4.76 37.49,7.43 v37.49,9.64 | v42.63,4.76 44.38,6.51 R39.P$2
  Bottom 0.152: R33.P$1 LT_I2C2.3 6.4,8.63 6.2,8.82 6.2,9.28 JP10.P$1 6.21,9.31 6.78,9.31 6.91,9.43 8.86,9.43 9.54,8.75 9.54,8.4 9.98,7.96 12.5,7.96 12.88,8.34 17.07,8.34 18.67,6.74 26.7,6.74 27.38,7.43 36.04,7.43 37.49,8.87 v37.49,9.64 37.49,10.9 U2.58 | R33.P$1 | v40.16,4.76 v42.63,4.76
SERVO_8/I2C1_SDA  (via drill 0.31)
  Top 0.152: v39.7,4.07 36.94,6.83 v36.94,9.08 | v43.09,4.07 44.38,5.37 R40.P$2
  Bottom 0.152: LT_I2C2.4 5.75,7.59 5.66,7.5 4.58,7.5 R34.P$1 4.6,7.51 4.6,8.06 4.51,8.14 JP11.P$1 4.66,8.81 5.31,9.46 5.31,9.81 5.51,10.02 7.74,10.02 7.94,9.81 9.04,9.81 9.88,8.98 9.88,8.52 10.13,8.27 12.34,8.27 12.72,8.65 17.22,8.65 18.82,7.05 26.54,7.05 27.23,7.73 35.81,7.73 36.94,8.86 v36.94,9.08 36.92,9.1 U2.59 | v39.7,4.07 v43.09,4.07
SERVO_BUS  (via drill 0.31)
  Top 0.406: JP1.P$1 44.54,11.01 v44.73,11.01
  Route15 0.813: v48.01,8.72 45.72,11.01 v44.73,11.01
  other vias: 50.22,16.8 50.22,17.41 50.22,16.19 50.22,25.33 50.22,25.94 50.22,24.72 48.62,24.88 49.22,24.88 48.01,24.88 50.29,8.87 50.29,8.26 50.29,7.66 48.62,8.72 49.22,8.72
  pour Route15 (isolate 0.254): 47.24,26.86 49.99,26.86 50.44,26.4 50.52,7.12 50.06,6.66 47.32,6.66 46.86,7.12 46.79,26.4
  pour Top (no thermals): 49.99,17.64 51.51,17.64 51.51,15.96 49.99,15.96
  pour Bottom (no thermals): 49.99,17.64 51.51,17.64 51.51,15.96 49.99,15.96
  pour Top (no thermals): 47.78,26.17 51.51,26.17 51.51,24.5 47.78,24.5
  pour Top (no thermals): 47.85,9.1 51.59,9.1 51.59,7.43 47.85,7.43
  pour Bottom (no thermals): 47.85,9.1 51.59,9.1 51.59,7.43 47.85,7.43
  pour Bottom (no thermals): 47.78,26.17 51.51,26.17 51.51,24.5 47.78,24.5
U1_U5_POW  (via drill 0.31)
  Top 0.406: JP8.P$2 JP9.P$2 26.29,6.21 | JP20.2 23.14,3.06 26.29,6.21 | JP20.5 30.76,2.69 R6.P$1 28.23,5.22 v27.74,5.22 27.28,5.22 26.29,6.21
  Bottom 0.406: R6.P$1 27.96,4.99 v27.74,5.22 27.51,4.99 R24.P$1
U2_POW  (via drill 0.31)
  Top 0.406: JP4.P$2 29.22,23.56 v29.71,23.56 30.02,23.87 30.02,27.85 32.05,29.88 JP16.2
  Bottom 0.406: JP5.P$2 29.71,24.22 v29.71,23.56 30.3,22.97 31.39,22.97 31.76,23.34 R26.P$1
U3_POW
  Bottom 0.406: R3.P$1 41.56,7.23 JP7.P$2 41.52,6.55 41.66,6.4 JP6.P$2 40.01,5.75 38.38,4.12 JP17.2
UART1_RX  (via drill 0.31)
  Bottom 0.152: U2.43 45.38,15.46 46.33,14.51 46.33,10.78 43.28,7.73 42.14,7.73 41.91,7.96 39.17,7.96 36.5,5.29 30.63,5.29 30.25,5.67 28.42,5.67 28.12,5.98 v27.74,5.98 27.58,5.83 26.59,5.83 26.02,5.25 R24.P$2 25.68,4.65 JP20.3
UART2_RX  (via drill 0.31)
  Top 0.152: JP16.4 26.97,25.24 v26.61,24.88
  Bottom 0.152: U2.17 34.01,22.46 32.77,23.71 R26.P$2 32.74,24.31 32.74,24.72 32.46,25 26.74,25 v26.61,24.88
UART2_TX  (via drill 0.31)
  Top 0.152: v27.91,21.24 v27.91,21.25 27.48,21.68 27.48,22.88 29.51,24.91 JP16.3
  Bottom 0.152: U2.16 31.06,20.46 30.28,21.24 v27.91,21.24
UART3_RX  (via drill 0.31)
  Top 0.152: v41.6,8.8 41.6,4 JP17.4
  Bottom 0.152: U2.52 40.42,10.28 40.23,10.09 40.23,9.48 40.92,8.8 v41.6,8.8 42.17,8.23 R3.P$2
UART3_TX  (via drill 0.31)
  Top 0.152: v40.77,9.79 40.77,2.3 JP17.3
  Bottom 0.152: U2.51 40.92,9.95 v40.77,9.79
UART5_RX  (via drill 0.31)
  Top 0.152: v31.01,6.13 30.18,5.29 v30.18,4.99 30.46,4.99 JP20.6
  Bottom 0.152: R6.P$2 v30.18,4.99 | v31.01,6.13 36.29,6.13 39.45,9.29 39.45,10.94 U2.54
USB_DM  (via drill 0.31)
  Top 0.152: R1.P$2 12.5,10.63 13.21,11.34 v13.76,11.34
  Bottom 0.152: U2.44 42.22,14.96 41.6,15.58 | v13.76,11.34 14.27,11.34 14.61,11.01 23.16,11.01 23.7,10.47 26.44,10.47 27.2,11.24 32.54,11.24 36.88,15.58 41.6,15.58 | 41.6,15.58 41.68,15.58
USB_DP  (via drill 0.31)
  Top 0.152: R2.P$2 11.51,9.18 13,10.68 v14.17,10.68
  Bottom 0.152: U2.45 41.75,14.46 40.99,15.22 37,15.22 32.71,10.93 27.43,10.93 26.59,10.09 23.41,10.09 23.01,10.5 14.35,10.5 v14.17,10.68
USB_VBUS  (via drill 0.31)
  Top 0.406: D3.A 8.64,13.98 v7.85,13.98 5.64,11.77 JP23.1
  Route15 0.406: v7.85,13.98 7.54,13.98 6.55,12.99 6.55,8.65 8.23,6.97 18.59,6.97 20.19,8.57 22.02,8.57 22.33,8.27 23.7,8.27 23.93,8.49 32.77,8.49 34.82,6.44 40.08,6.44 40.54,6.89 40.54,8.42 39.85,9.1 39.85,11.08 42.21,13.45 v42.21,15.73
  Bottom 0.152: v42.21,15.73 42.45,15.96 U2.42
V_BAT
  Top 0.406: R17.P$1 9.93,24.23 JP2.P$2 7,27.01 JP21.2
V_BAT_MEAS  (via drill 0.31)
  Top 0.152: R18.P$1 10.57,22.66 R17.P$2 11.64,23.23 12.3,23.89 18.66,23.89 19.25,23.31 v19.25,22.82
  Bottom 0.152: U2.24 37.92,21.76 37.61,21.45 36.65,21.45 36.07,20.86 33.98,20.86 33.5,21.35 31.37,21.35 30.5,22.21 29.06,22.21 28.35,22.92 19.35,22.92 v19.25,22.82
V_IN  (via drill 0.31)
  Top 0.152: C39.+ 42.31,12.66
  Top 0.406: VREG1.2 44.32,15.94 44.8,16.42 45.3,16.42 C38.P$1 | D3.C 9.11,15.62 C3.P$1 10.07,16.63 10.92,17.48 10.92,18.05 IC9.3 10.14,18.06 9.7,18.5 9.7,19.7 9.96,19.96 IC9.1 10.64,20.23 JP3.P$1 10.08,21.14 9.85,21.38 JP2.P$1 3.31,23.31 JP21.3 | v20.83,7.88 21,7.88 R23.P$2 21.98,8.37 22.25,8.65 22.25,9.33 22.63,9.71 24,9.71 24.31,10.02 24.31,10.78 24.5,10.97 JP8.P$1 | v28.12,22.36 28.14,22.34 JP4.P$1 | 42.31,12.66 43.33,11.64 v43.81,11.64 | 42.31,12.83 42.31,11.32 JP1.P$2
  Top 0.508: VREG1.1 VREG1.2
  Top 0.61: C39.+ 42.31,12.83 42.31,14.28 42.7,14.67 VREG1.1
  Bottom 0.406: 24.51,21.88 IMU.P$2 26.66,21.88 v26.69,21.85 | JP6.P$1 42.59,5.84 v42.59,6.51
  pour Route15 (isolate 0.254): 44.09,11.95 44.09,0 0,0 0,29.41 25.55,29.41 25.55,22.69 28.35,22.69 28.35,20.91 25.04,20.91 23.77,22.18 23.77,27.01 9.04,27.01 6.3,23.66 6.22,8.77 8,6.97 19.33,6.97 20.78,8.42 20.73,8.42 32.46,8.49 32.41,8.47 34.44,6.44 40.28,6.44 41.55,7.71 41.55,11.95
VDDA
  Bottom 0.305: U2.13 31.33,18.96 31.18,19.12 C31.P$2 29.65,19.12 29.4,18.87 28.44,18.87 | C28.+ 28.44,18.87 | 28.44,18.87 L1.P$2
VSS1
  Bottom 0.152: U2.31 41.42,23.81 JP12.P$1
  Bottom 0.406: C7.P$2 41.6,23.84 JP12.P$1
VSS2  (via drill 0.31)
  Top 0.406: JP13.P$1 45.15,13.64 v44.96,13.45 44.69,13.72 C14.P$2
  Bottom 0.305: U2.47 44.94,13.46 v44.96,13.45

## Text on the board
Top: LIA_V1_0_R0 TOP LAYER
Route2: LIA_V1_0_R0 LAYER 2
Route15: LIA_V1_0_R0 LAYER 3
Bottom: LIA_V1_0_R0 BOTTOM LAYER
tPlace: LIA_V1_0_R0 SILK SCREEN TOP | S1 | DRDY | SS | SCK | MISO | MOSI | 3V3 | GND | RX | TX | VCC | GND | SDA | GND | SCL | 3V3 | GND | CAN | BVS | JP2 | SPI1 | UART2 | I2C2 | Lia | V1.0 | S2 | VIN | (C)TR | 2011 | VIN | S3 | CAN | CL | LOW | ALOG2 | ALOG1 | CH | HI | CL | DA | I2C1 | S4 | SCL | L9 | L3 | S5 | L7 | L5 | SDA | L8 | REG3V3 | L1 | VIN | L6 | 3V3 | L2 | CMP2 | UBUS | LVIN | VS | D- | USB | JTAG | RC | RX | UART1 | S6 | GPIO | S7 | D+ | GND | GND | 3V3 | PC12 | TRST | GND | 3V3 | RX3 | GND | 3V3 | RX5 | GND | VCC | TX | RX | S8
bPlace: LIA_V1_0_R0 SILK SCREEN BOTTOM | S1 | 2011 | Lia | CC-BY-SA 3.0 | v1.0 | UAV | Paparazzi | GND | (C)TR | CMP1 | S2 | 3V3 | S3 | ACC_DRDY | GND | ASPIRIN_IMU | V_IN | ACC_CS | MISO | SDA | S4 | MOSI | S5 | SCL | GYRO_DRDY | SCK | MAG_DRDY | GYRO_SS | Robotics | Transition | S6 | GND | 3V3 | S7 | USB | V_IN | S8
tNames: J1&2 | J3&4 | Q1 | JTAG | J5&6 | CON_USB | J7&8
tStop: LIA_V1_0_R0 SOLDER MASK TOP
bStop: LIA_V1_0_R0 SOLDER MASK BOTTOM
tCream: LISA_M_V1_1_R0 SOLDER PASTE TOP
bCream: LISA_M_V1_1_R0 SOLDER PASTE BOTTOM
Reference: (C) 2010-2011 Antoine Drouin <poinix@gmail.com> | (C) 2010-2012 Piotr Esden-Tempski <piotr@esden.net> | Licensed under: | (C) 2011 Richard Hatano <rhatano@jobyenergy.com> | CC-BY-SA 3.0 | (C) 2011 Joby Robotics <info@jobyrobotics.com> | (C) 2011-2012 Transition Robotics <info@transition-robotics.com> | http://creativecommons.org/licenses/by-sa/3.0/